# EAGLE design charger_pcb (EAGLE 7.3.0)
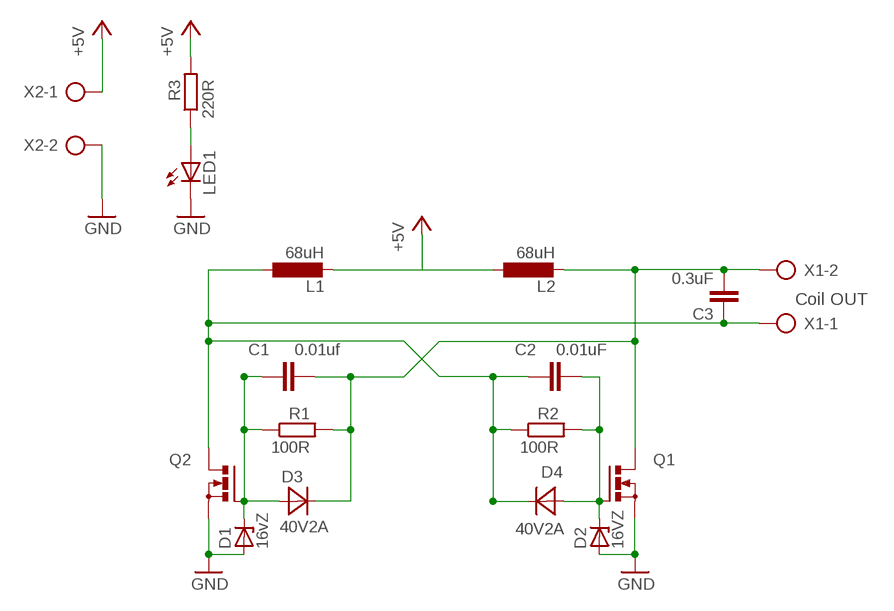
[diagram p0: schematic, sheet 1]

## Parts
C1  0.01uf  C-EUC0805  [C0805]
C2  0.01uF  C-EUC0805  [C0805]
C3  0.3uF  C-EUC0805  [C0805]
D1  16vZ  ZENER-DIODESOD80C  [SOD80C]
D2  16VZ  ZENER-DIODESOD80C  [SOD80C]
D3  40V2A  MBRA340T3  [SMA]
D4  40V2A  MBRA340T3  [SMA]
L1  68uH  L-EUL5650M  [L5650M]
L2  68uH  L-EUL5650M  [L5650M]
LED1  LEDCHIP-LED0805  [CHIP-LED0805]
Q1  N-MOSFET-SO8S  [SO-08]
Q2  N-MOSFET-SO8S  [SO-08]
R1  100R  R-EU_R0805  [R0805]
R2  100R  R-EU_R0805  [R0805]
R3  220R  R-EU_R0805  [R0805]
X1  AK500/2  [AK500/2]
X2  AK500/2  [AK500/2]

## Nets
+5V: L1.2 L2.1 R3.2 X2.1
GND: D1.A D2.A LED1.C Q1.1(S) Q1.2(S) Q1.3(S) Q2.1(S) Q2.2(S) Q2.3(S) X2.2
N$1: C1.1 D1.C D3.A Q2.4(G) R1.1
N$2: C1.2 C3.2 D3.C L2.2 Q1.5(D) Q1.6(D) Q1.7(D) Q1.8(D) R1.2 X1.2
N$3: C2.2 D2.C D4.A Q1.4(G) R2.2
N$4: C2.1 C3.1 D4.C L1.1 Q2.5(D) Q2.6(D) Q2.7(D) Q2.8(D) R2.1 X1.1
N$5: LED1.A R3.1

## Notes on the sheet
- Coil OUT

## Library data of the parts
C1-C3 = rcl:C-EU: CAPACITOR, European symbol
D1 D2 = diode:ZENER-DIODE: Z-Diode
D3 D4 = diode:MBRA340T3: Surface Mount Schottky Power Rectifier Source: http://www.onsemi.com/pub_link/Collateral/MBRA340T3-D.PDF
L1 L2 = rcl:L-EU: INDUCTOR, European symbol
LED1 = led:LED: LED OSRAM: - CHIPLED LG R971, LG N971, LY N971, LG Q971, LY Q971, LO R971, LY R971 LH N974, LH R974 LS Q976, LO Q976, LY Q976 LO Q996 - Hyper CHIPLED LW Q18S LB Q993, LB Q99A, LB R99A - SideLED LS A670, LO A670, LY A670, LG A670, LP A670 LB A673, LV A673, LT A673, LW A673 LH A674 LY A675 LS A676, LA A676, LO A676, LY A676, LW A676 LS A679, LY A679, LG A679 - Hyper Micro SIDELED® LS Y876, LA Y876, LO Y876, LY Y876 LT Y87S - SmartLED LW L88C, LW L88S LB L89C, LB L89S, LG L890 LS L89K, LO L89K, LY L89K LS L896, LA L896, LO L896, LY L896 - TOPLED LS T670, LO T670, LY T670, LG T670, LP T670 LSG T670, LSP T670, LSY T670, LOP T670, LYG T670 LG T671, LOG T671, LSG T671 LB T673, LV T673, LT T673, LW T673 LH T674 LS T676, LA T676, LO T676, LY T676, LB T676, LH T676, LSB T676, LW T676 LB T67C, LV T67C, LT T67C, LS T67K, LO T67K, LY T67K, LW E67C LS E67B, LA E67B, LO E67B, LY E67B, LB E67C, LV E67C, LT E67C LW T67C LS T679, LY T679, LG T679 LS T770, LO T770, LY T770, LG T770, LP T770 LB T773, LV T773, LT T773, LW T773 LH T774 LS E675, LA E675, LY E675, LS T675 LS T776, LA T776, LO T776, LY T776, LB T776 LHGB T686 LT T68C, LB T68C - Hyper Mini TOPLED® LB M676 - Mini TOPLED Santana® LG M470 LS M47K, LO M47K, LY M47K Source: http://www.osram.convergy.de LUXEON: - LUMILED® LXK2-PW12-R00, LXK2-PW12-S00, LXK2-PW14-U00, LXK2-PW14-V00 LXK2-PM12-R00, LXK2-PM12-S00, LXK2-PM14-U00 LXK2-PE12-Q00, LXK2-PE12-R00, LXK2-PE12-S00, LXK2-PE14-T00, LXK2-PE14-U00 LXK2-PB12-K00, LXK2-PB12-L00, LXK2-PB12-M00, LXK2-PB14-N00, LXK2-PB14-P00, LXK2-PB14-Q00 LXK2-PR12-L00, LXK2-PR12-M00, LXK2-PR14-Q00, LXK2-PR14-R00 LXK2-PD12-Q00, LXK2-PD12-R00, LXK2-PD12-S00 LXK2-PH12-R00, LXK2-PH12-S00 LXK2-PL12-P00, LXK2-PL12-Q00, LXK2-PL12-R00 Source: www.luxeon.com KINGBRIGHT: KA-3528ASYC Source: www.kingbright.com
Q1 Q2 = transistor-power:N-MOSFET-SO8: N-Channel MOSFET Example: FDS7760A; N-Channel Logic Level PowerTrench® MOSFET FDS2572; N-Channel UltraFET® Trench MOSFET Source: www.fairchildsemi.com
R1-R3 = rcl:R-EU_: RESISTOR, European symbol
X1 X2 = con-ptr500:AK500/2: CONNECTOR; OC_FARNELL: unknown; OC_NEWARK: unknown

## Board
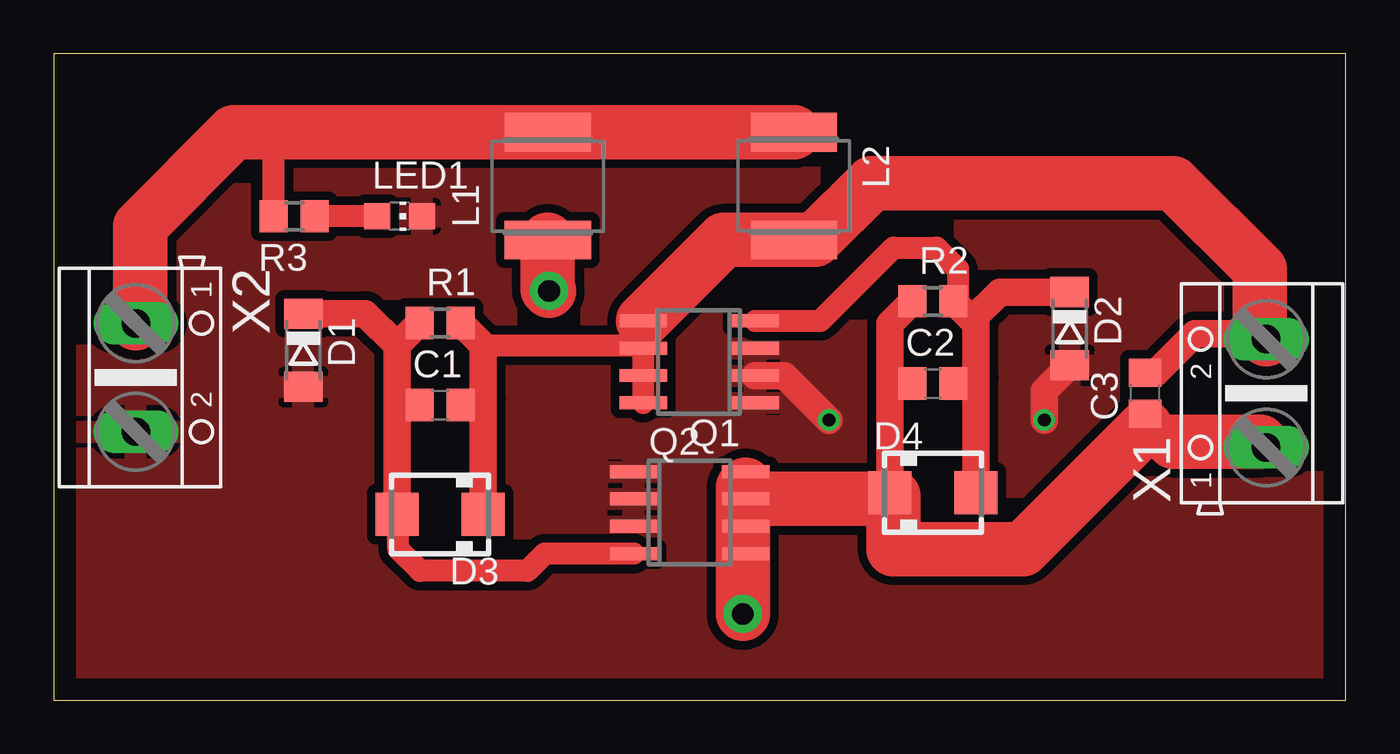
[diagram p1: board, top side]
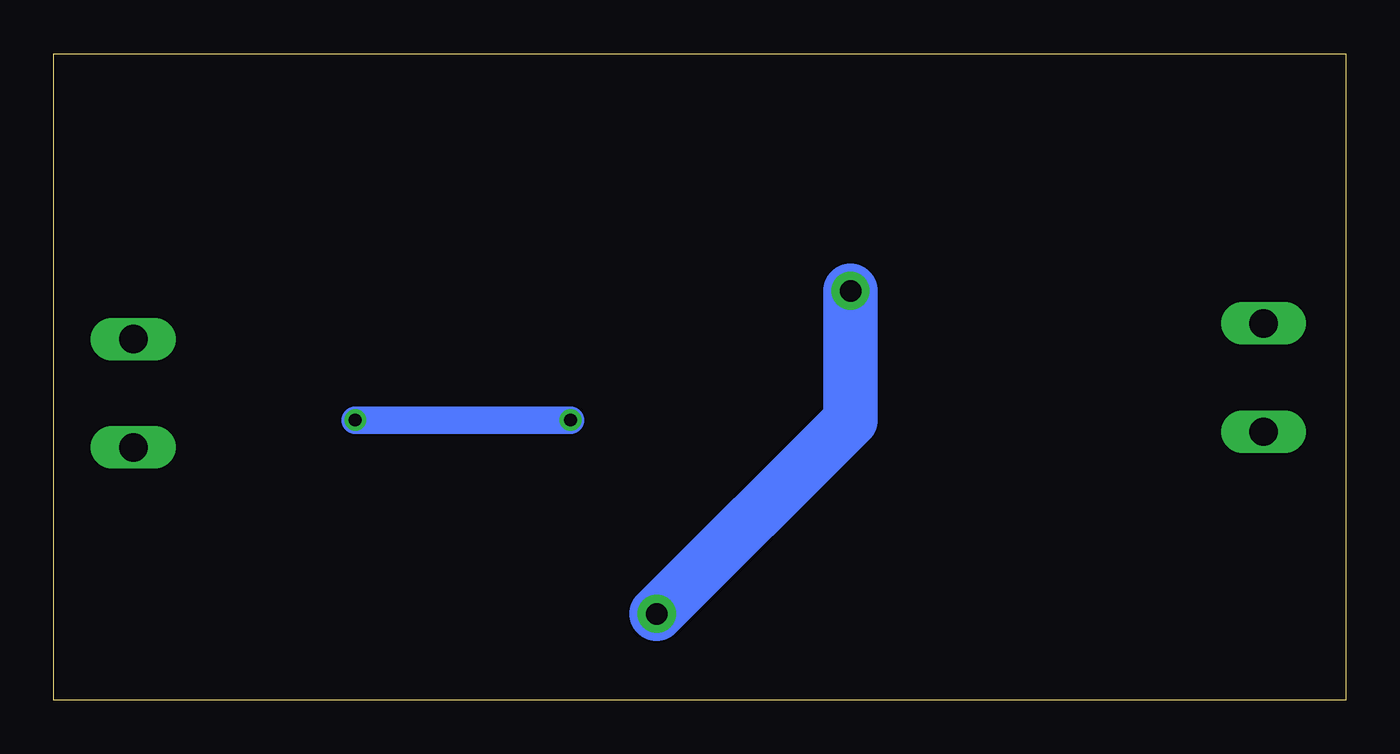
[diagram p2: board, bottom side, seen from below]

Size 60 x 30 mm. Coordinates in mm from the lower left corner, seen from the top.
Outline: 0,0 60,0 60,30 0,30 0,0
Copper layers (1*16): Top 0.035mm / dielectric 1.5mm / Bottom 0.035mm
Design rules "default": minimum track width 10mil, minimum drill 24mil, track to track 8mil, track to pad 8mil, pad to pad 8mil, via to via 8mil, smd to smd 8mil, copper to edge 40mil, drill to drill 8mil, minimum pad ring 10mil, minimum via ring 8mil, stop-mask expansion 4mil, vias tented up to drill 0mil, thermal gap 10mil

### Footprints (pad centres in the part's own frame; a part is rotated, then mirrored left to right if it is on the bottom)
C0805 = smd 1.3 x 1.5: 1 -0.95,0; 2 0.95,0
SOD80C = smd 1.4 x 1.8: A 1.7,0; C -1.7,0
SMA = smd 2 x 2: A 2,0; C -2,0
L5650M = smd 1.8 x 4: 1 -2.5,0; 2 2.5,0
CHIP-LED0805 = smd 1.2 x 1.2: A 0,-1.05; C 0,1.05
SO-08 = smd 0.6 x 2.2: 1 -1.905,-2.6; 2 -0.635,-2.6; 3 0.635,-2.6; 4 1.905,-2.6; 5 1.905,2.6; 6 0.635,2.6; 7 -0.635,2.6; 8 -1.905,2.6
R0805 = smd 1.3 x 1.5: 1 -0.95,0; 2 0.95,0
AK500/2 = drill 1.321 long: 1 -2.515,0; 2 2.515,0

### Placement (x,y rotation side)
C1  17.94,13.7 0 top
C2  40.83,14.7 0 top
C3  50.69,14.24 90 top
D1  11.59,16.24 270 top
D2  47.18,17.24 270 top
D3  17.94,8.62 180 top
D4  40.83,9.62 0 top
L1  22.94,23.86 90 top
L2  34.37,23.86 270 top
LED1  16.06,22.46 270 top
Q1  29.97,15.7 90 top
Q2  29.53,8.7 270 top
R1  17.94,17.51 0 top
R2  40.83,18.51 0 top
R3  11.17,22.46 180 top
X1  56.31,14.24 90 top
X2  3.81,14.97 270 top

### Tracks (layer width: path | path; a pad name or v marks a point on that pad's centre or on a via)
+5V
  Top 1.016: R3.2 10.22,26.14 10,26.36
  Top 2.54: L2.1 L1.2 10,26.36 8.36,26.36 4,22 4,17.68 X2.1
GND  (via drill 0.6)
  Top 1.27: Q1.2 33.94,15.06 v36,13 | v46,13 46,14.36 D2.A
  Bottom 1.27: v36,13 v46,13
  pour Top (isolate 0.406): 0,0 0,30 60,30 60,0
N$1
  Top 1.016: Q2.4 22.8,6.79 22,6 17,6 16,7 16,8.56 D3.A
  Top 1.27: D3.A 15.94,14 | 15.94,14 15.94,16.46 | 15.94,16.46 R1.1 | C1.1 16.24,13.7 15.94,14 | D1.C 14.46,17.94 15.94,16.46
N$2
  Top 1.016: 19.94,16.46 27.25,16.46 Q1.6 | Q1.6 Q1.5 27.61,17.61 28,18 27,18 27,16.7 Q1.6 | Q1.6 Q1.7 Q1.8
  Top 1.27: D3.C 19.94,14 | 19.94,14 19.94,16.46 R1.2 | C1.2 19.64,13.7 19.94,14 | C3.2 51.19,15.19 53,17 56.06,17 X1.2
  Top 2.54: Q1.5 31.12,21.36 L2.2 35.36,21.36 38,24 52,24 56,20 56,17.07 X1.2
N$3
  Top 1.016: Q1.4 35.6,17.61 39,21 41,21 42,20 42,18.73 R2.2
  Top 1.27: D4.A 42.83,15 | 42.83,15 42.83,17.46 42.65,17.64 | 42.65,17.64 R2.2 | C2.2 42.53,14.7 42.83,15 | D2.C 43.94,18.94 42.65,17.64
N$4  (via drill 1 pad 1.78)
  Top 1.016: 38.55,9.34 D4.C 39,9.45 | Q2.8 32.13,10 Q2.7 Q2.6 Q2.5 | C3.1 50.69,12.69
  Top 1.27: D4.C 38.83,15 | 38.83,15 38.83,17.46 R2.1 | C2.1 39.13,14.7 38.83,15 | 50.69,12.69 51.31,12.69 52,12 | 56.03,12 X1.1
  Top 2.54: Q2.7 38.55,9.34 | 50.69,12.69 45,7 39,7 39,9.45 | L1.1 22.94,19.06 v23,19 | v32,4 32,9.87 32.13,10 | 52,12 56.03,12
  Bottom 2.54: v23,19 23,13 v32,4
N$5
  Top 1.016: LED1.A R3.1